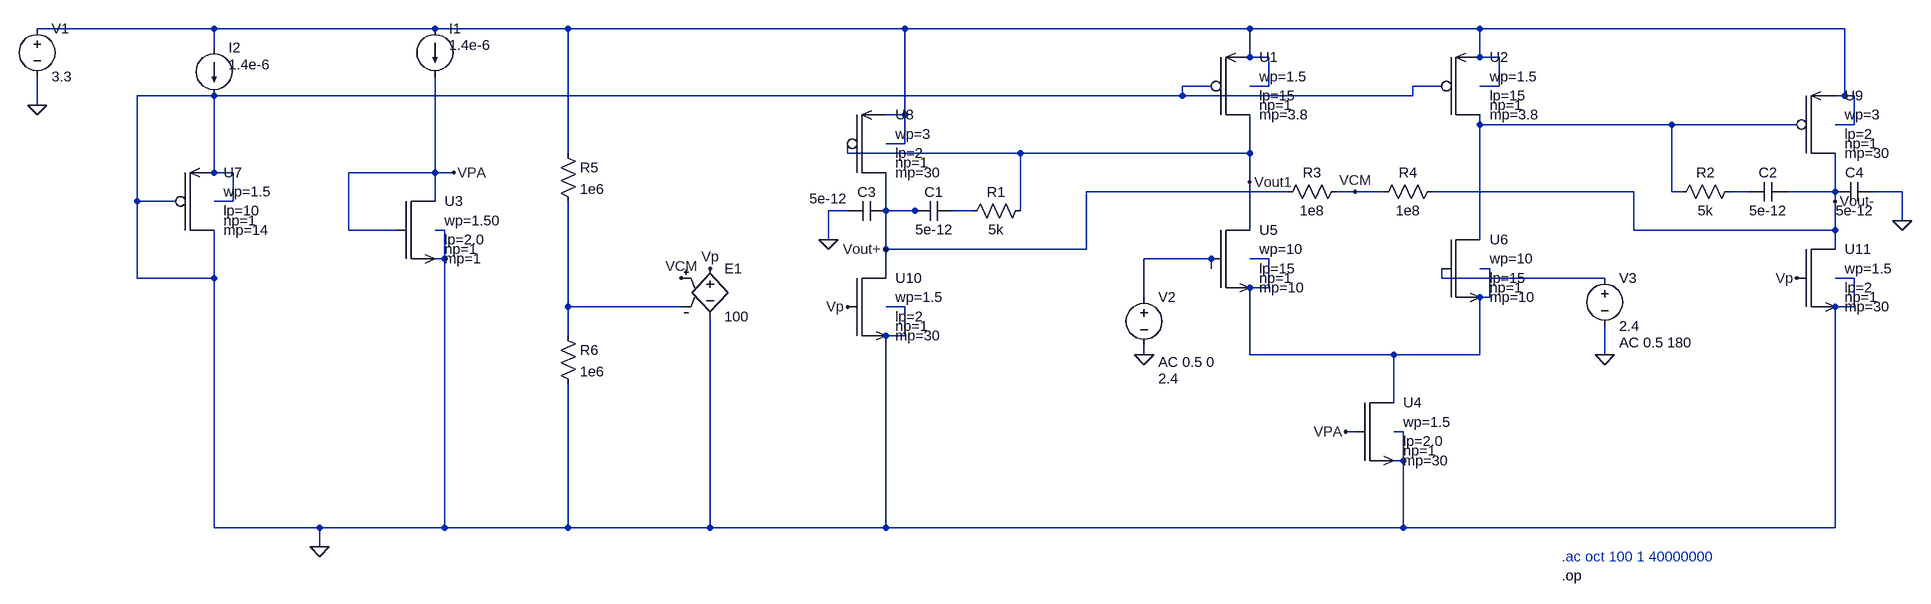
[diagram p0: schematic Draft3.asc]
Draft3.asc, the LTspice schematic file:
Version 4.1
SHEET 1 1768 1072
WIRE -2240 16 -2880 16
WIRE -1872 16 -2240 16
WIRE -1408 16 -1872 16
WIRE -528 16 -1408 16
WIRE 128 16 -528 16
WIRE 512 16 128 16
WIRE 1120 16 512 16
WIRE -2240 48 -2240 16
WIRE 128 64 128 16
WIRE 160 64 128 64
WIRE 512 64 512 16
WIRE 512 64 496 64
WIRE 544 64 512 64
WIRE 64 112 16 112
WIRE 160 112 160 64
WIRE 160 112 128 112
WIRE 448 112 400 112
WIRE 544 112 544 64
WIRE 544 112 512 112
WIRE -2240 128 -2368 128
WIRE 16 128 16 112
WIRE 16 128 -2240 128
WIRE 400 128 400 112
WIRE 400 128 16 128
WIRE 1120 128 1120 16
WIRE 1120 128 1104 128
WIRE 1136 128 1120 128
WIRE -2880 144 -2880 96
WIRE -528 160 -528 16
WIRE -528 160 -560 160
WIRE 512 176 512 160
WIRE 832 176 512 176
WIRE 1040 176 832 176
WIRE 1136 176 1136 128
WIRE 1136 176 1104 176
WIRE -528 208 -528 160
WIRE -528 208 -560 208
WIRE -1408 224 -1408 16
WIRE -624 224 -624 208
WIRE -336 224 -624 224
WIRE 128 224 128 160
WIRE 128 224 -336 224
WIRE -2240 256 -2240 128
WIRE -2240 256 -2256 256
WIRE -2208 256 -2240 256
WIRE -1872 256 -1872 96
WIRE -1872 256 -2016 256
WIRE -1840 256 -1872 256
WIRE 128 272 128 224
WIRE 192 288 -144 288
WIRE 304 288 272 288
WIRE 352 288 304 288
WIRE 768 288 432 288
WIRE 832 288 832 176
WIRE 848 288 832 288
WIRE 960 288 928 288
WIRE 1104 288 1104 224
WIRE 1104 288 1024 288
WIRE 1216 288 1168 288
WIRE -2368 304 -2368 128
WIRE -2304 304 -2368 304
WIRE -2208 304 -2208 256
WIRE -2208 304 -2240 304
WIRE -1872 304 -1872 256
WIRE 1104 304 1104 288
WIRE -624 320 -656 320
WIRE -560 320 -560 256
WIRE -560 320 -576 320
WIRE -512 320 -560 320
WIRE -496 320 -512 320
WIRE -416 320 -448 320
WIRE -336 320 -336 224
WIRE 1216 336 1216 288
WIRE -2016 352 -2016 256
WIRE -1936 352 -2016 352
WIRE -1856 352 -1872 352
WIRE 128 352 128 272
WIRE 768 352 768 288
WIRE 1104 352 1104 304
WIRE 1104 352 768 352
WIRE -656 368 -656 320
WIRE 512 368 512 176
WIRE -560 384 -560 320
WIRE -144 384 -144 288
WIRE -144 384 -560 384
WIRE 1104 384 1104 352
WIRE -1856 400 -1856 352
WIRE -1856 400 -1872 400
WIRE 64 400 -48 400
WIRE 160 400 128 400
WIRE 64 416 64 400
WIRE 528 416 512 416
WIRE -2368 432 -2368 304
WIRE -2240 432 -2240 352
WIRE -2240 432 -2368 432
WIRE -560 432 -560 384
WIRE 448 432 448 416
WIRE 720 432 448 432
WIRE 1136 432 1104 432
WIRE 128 448 112 448
WIRE 160 448 160 400
WIRE 160 448 128 448
WIRE -48 464 -48 400
WIRE 528 464 528 416
WIRE 528 464 512 464
WIRE -1408 480 -1408 304
WIRE -1136 480 -1408 480
WIRE -528 480 -560 480
WIRE 1104 480 1088 480
WIRE 1136 480 1136 432
WIRE 1136 480 1104 480
WIRE -1408 528 -1408 480
WIRE -560 528 -576 528
WIRE -528 528 -528 480
WIRE -528 528 -560 528
WIRE -48 560 -48 544
WIRE 128 560 128 448
WIRE 368 560 128 560
WIRE 512 560 512 464
WIRE 512 560 368 560
WIRE 720 560 720 512
WIRE 368 640 368 560
WIRE 304 688 288 688
WIRE 384 688 368 688
WIRE 384 736 384 688
WIRE 384 736 368 736
WIRE -2240 848 -2240 432
WIRE -2064 848 -2240 848
WIRE -1856 848 -1856 400
WIRE -1856 848 -2064 848
WIRE -1408 848 -1408 608
WIRE -1408 848 -1856 848
WIRE -1088 848 -1088 496
WIRE -1088 848 -1408 848
WIRE -560 848 -560 528
WIRE -560 848 -1088 848
WIRE 384 848 384 736
WIRE 384 848 -560 848
WIRE 1104 848 1104 480
WIRE 1104 848 384 848
WIRE -2064 880 -2064 848
FLAG -2064 880 0
FLAG -2880 144 0
FLAG -48 560 0
FLAG 720 560 0
FLAG -560 384 Vout+
FLAG 1104 304 Vout-
FLAG -656 368 0
FLAG 1216 336 0
FLAG 128 272 Vout1
FLAG 304 288 VCM
FLAG -1136 432 VCM
FLAG -1088 416 Vp
FLAG -624 480 Vp
FLAG 1040 432 Vp
FLAG -1840 256 VPA
FLAG 288 688 VPA
SYMBOL gfmcu_pmos3p3 64 112 R0
SYMATTR InstName U1
SYMATTR Value wp=1.5
SYMATTR Value2 lp=15
SYMATTR SpiceLine2 mp=3.8
SYMBOL gfmcu_pmos3p3 448 112 R0
SYMATTR InstName U2
SYMATTR Value wp=1.5
SYMATTR Value2 lp=15
SYMATTR SpiceLine2 mp=3.8
SYMBOL gfmcu_nmos3p3 -1936 352 R0
SYMATTR InstName U3
SYMATTR Value2 lp=2.0
SYMBOL gfmcu_nmos3p3 304 688 R0
SYMATTR InstName U4
SYMATTR Value wp=1.5
SYMATTR Value2 lp=2.0
SYMATTR SpiceLine2 mp=30
SYMBOL gfmcu_nmos3p3 64 400 R0
SYMATTR InstName U5
SYMATTR Value wp=10
SYMATTR Value2 lp=15
SYMATTR SpiceLine2 mp=10
SYMBOL gfmcu_nmos3p3 448 416 R0
SYMATTR InstName U6
SYMATTR Value wp=10
SYMATTR Value2 lp=15
SYMATTR SpiceLine2 mp=10
SYMBOL current -1872 16 R0
WINDOW 3 24 28 Left 2
WINDOW 123 0 0 Left 0
WINDOW 39 0 0 Left 0
SYMATTR Value 1.4e-6
SYMATTR InstName I1
SYMBOL voltage -2880 0 R0
WINDOW 123 0 0 Left 0
WINDOW 39 0 0 Left 0
SYMATTR InstName V1
SYMATTR Value 3.3
SYMBOL voltage -48 448 R0
WINDOW 3 24 152 Left 2
WINDOW 123 24 124 Left 2
WINDOW 39 0 0 Left 0
SYMATTR Value 2.4
SYMATTR Value2 AC 0.5 0
SYMATTR InstName V2
SYMBOL voltage 720 416 R0
WINDOW 123 24 124 Left 2
WINDOW 39 0 0 Left 0
SYMATTR Value2 AC 0.5 180
SYMATTR InstName V3
SYMATTR Value 2.4
SYMBOL gfmcu_pmos3p3 -2304 304 R0
SYMATTR InstName U7
SYMATTR Value wp=1.5
SYMATTR Value2 lp=10
SYMATTR SpiceLine2 mp=14
SYMBOL current -2240 48 R0
WINDOW 3 24 28 Left 2
WINDOW 123 0 0 Left 0
WINDOW 39 0 0 Left 0
SYMATTR Value 1.4e-6
SYMATTR InstName I2
SYMBOL gfmcu_pmos3p3 -624 208 R0
SYMATTR InstName U8
SYMATTR Value wp=3
SYMATTR Value2 lp=2
SYMATTR SpiceLine2 mp=30
SYMBOL gfmcu_pmos3p3 1040 176 R0
SYMATTR InstName U9
SYMATTR Value wp=3
SYMATTR Value2 lp=2
SYMATTR SpiceLine2 mp=30
SYMBOL gfmcu_nmos3p3 -624 480 R0
SYMATTR InstName U10
SYMATTR Value wp=1.5
SYMATTR Value2 lp=2
SYMATTR SpiceLine2 mp=30
SYMBOL gfmcu_nmos3p3 1040 432 R0
SYMATTR InstName U11
SYMATTR Value wp=1.5
SYMATTR Value2 lp=2
SYMATTR SpiceLine2 mp=30
SYMBOL cap -560 304 R90
WINDOW 0 0 32 VBottom 2
WINDOW 3 -20 96 VTop 2
SYMATTR InstName C3
SYMATTR Value 5e-12
SYMBOL cap 1168 272 R90
WINDOW 0 0 32 VBottom 2
WINDOW 3 32 32 VTop 2
SYMATTR InstName C4
SYMATTR Value 5e-12
SYMBOL res -320 304 R90
WINDOW 0 0 56 VBottom 2
WINDOW 3 32 56 VTop 2
SYMATTR InstName R1
SYMATTR Value 5k
SYMBOL cap -448 304 R90
WINDOW 0 0 32 VBottom 2
WINDOW 3 32 32 VTop 2
SYMATTR InstName C1
SYMATTR Value 5e-12
SYMBOL res 832 304 R270
WINDOW 0 32 56 VTop 2
WINDOW 3 0 56 VBottom 2
SYMATTR InstName R2
SYMATTR Value 5k
SYMBOL cap 960 304 R270
WINDOW 0 32 32 VTop 2
WINDOW 3 0 32 VBottom 2
SYMATTR InstName C2
SYMATTR Value 5e-12
SYMBOL res 288 272 R90
WINDOW 0 0 56 VBottom 2
WINDOW 3 32 56 VTop 2
SYMATTR InstName R3
SYMATTR Value 1e8
SYMBOL res 448 272 R90
WINDOW 0 0 56 VBottom 2
WINDOW 3 32 56 VTop 2
SYMATTR InstName R4
SYMATTR Value 1e8
SYMBOL e -1088 400 R0
SYMATTR InstName E1
SYMATTR Value 100
SYMBOL res -1424 208 R0
SYMATTR InstName R5
SYMATTR Value 1e6
SYMBOL res -1424 512 R0
SYMATTR InstName R6
SYMATTR Value 1e6
TEXT 648 896 Left 2 ;.ac oct 100 1 40000000
TEXT 648 928 Left 2 !.op

The netlist it stands for:
* Draft3.asc
X§U1 Vout1 0 N001 N001 gfmcu_pmos3p3 wp=1.5 lp=15 np=1 mp=3.8  ; pins ND NG NS NB
X§U2 N002 0 N001 N001 gfmcu_pmos3p3 wp=1.5 lp=15 np=1 mp=3.8  ; pins ND NG NS NB
X§U3 VPA VPA 0 0 gfmcu_nmos3p3 wp=1.50 lp=2.0 np=1 mp=1  ; pins ND NG NS NB
X§U4 N006 VPA 0 0 gfmcu_nmos3p3 wp=1.5 lp=2.0 np=1 mp=30  ; pins ND NG NS NB
X§U5 Vout1 N005 N006 N006 gfmcu_nmos3p3 wp=10 lp=15 np=1 mp=10  ; pins ND NG NS NB
X§U6 N002 N007 N006 N006 gfmcu_nmos3p3 wp=10 lp=15 np=1 mp=10  ; pins ND NG NS NB
I1 N001 VPA 1.4e-6
V1 N001 0 3.3
V2 N005 0 2.4 AC 0.5 0
V3 N007 0 2.4 AC 0.5 180
X§U7 0 0 0 0 gfmcu_pmos3p3 wp=1.5 lp=10 np=1 mp=14  ; pins ND NG NS NB
I2 N001 0 1.4e-6
X§U8 Vout+ Vout1 N001 N001 gfmcu_pmos3p3 wp=3 lp=2 np=1 mp=30  ; pins ND NG NS NB
X§U9 Vout- N002 N001 N001 gfmcu_pmos3p3 wp=3 lp=2 np=1 mp=30  ; pins ND NG NS NB
X§U10 Vout+ Vp 0 0 gfmcu_nmos3p3 wp=1.5 lp=2 np=1 mp=30  ; pins ND NG NS NB
X§U11 Vout- Vp 0 0 gfmcu_nmos3p3 wp=1.5 lp=2 np=1 mp=30  ; pins ND NG NS NB
C3 Vout+ 0 5e-12
C4 0 Vout- 5e-12
R1 Vout1 N004 5k
C1 N004 Vout+ 5e-12
R2 N002 N003 5k
C2 N003 Vout- 5e-12
R3 VCM Vout+ 1e8
R4 Vout- VCM 1e8
E1 Vp 0 VCM N008 100
R5 N001 N008 1e6
R6 N008 0 1e6
* .ac oct 100 1 40000000
.op
.lib models_gfmcu.lib
.backanno
.end